# EAGLE design WCRL_Board_V3 (EAGLE 9.6.2)
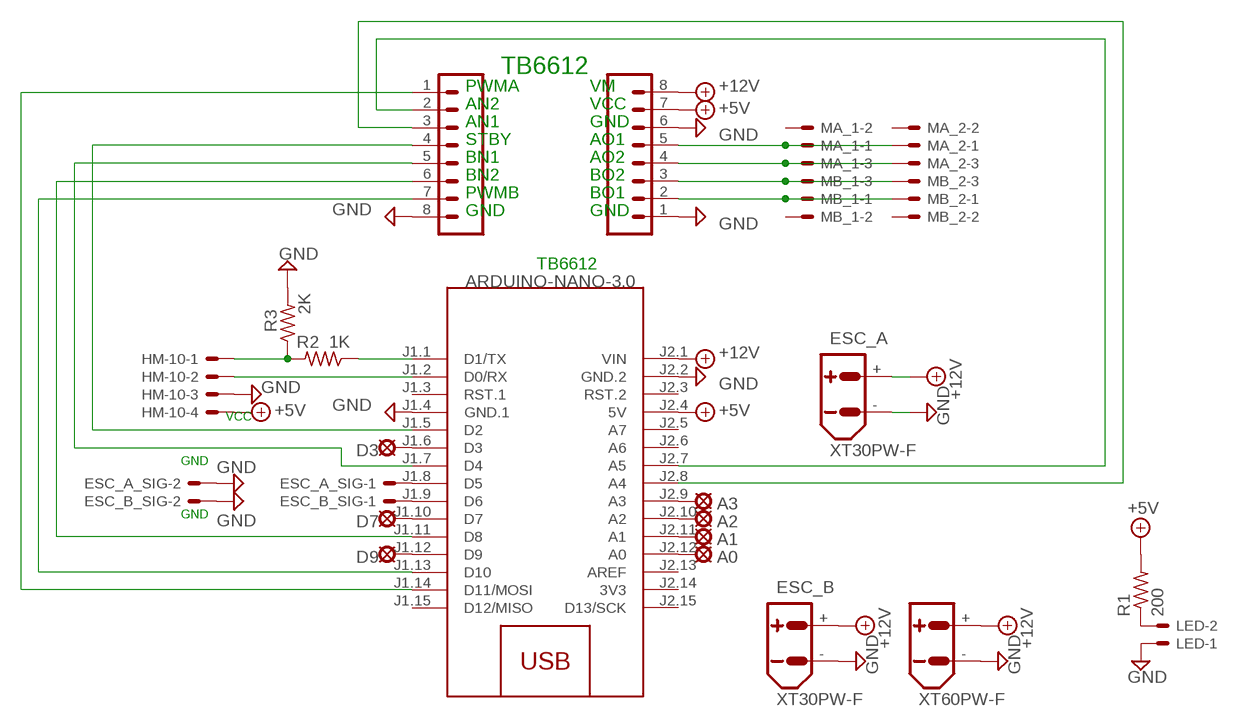
[diagram p0: schematic, sheet 1]

## Parts
A0  LSP10  [LSP10]
A1  LSP10  [LSP10]
A2  LSP10  [LSP10]
A3  LSP10  [LSP10]
BATTERY  XT60PW-F  [XT60PW-F]
D3  LSP10  [LSP10]
D7  LSP10  [LSP10]
D9  LSP10  [LSP10]
ESC_A  XT30PW-F  [XT30PW-F]
ESC_A_SIG  JST-XH-02-PIN-LONG-PAD  [JST-XH-02-PACKAGE-LONG-PAD]
ESC_B  XT30PW-F  [XT30PW-F]
ESC_B_SIG  JST-XH-02-PIN-LONG-PAD  [JST-XH-02-PACKAGE-LONG-PAD]
HM-10  JST-XH-04-PIN-LONG-PAD  [JST-XH-04-PACKAGE-LONG-PAD]
J1  CONN_08NO_SILK_FEMALE_PTH  [1X08_NO_SILK]
J2  CONN_08NO_SILK_FEMALE_PTH  [1X08_NO_SILK]
LED  JST-XH-02-PIN-LONG-PAD  [JST-XH-02-PACKAGE-LONG-PAD]
M1  ARDUINO-NANO-3.0  [ARDUINO-NANO-3.0]
MA_1  JST-XH-03-PIN-LONG-PAD  [JST-XH-03-PACKAGE-LONG-PAD]
MA_2  JST-XH-03-PIN-LONG-PAD  [JST-XH-03-PACKAGE-LONG-PAD]
MB_1  JST-XH-03-PIN-LONG-PAD  [JST-XH-03-PACKAGE-LONG-PAD]
MB_2  JST-XH-03-PIN-LONG-PAD  [JST-XH-03-PACKAGE-LONG-PAD]
R1  200  R-US_0204/5  [0204/5]
R2  1K  R-US_0204/5  [0204/5]
R3  2K  R-US_0204/5  [0204/5]

## Nets
+5V: HM-10.4 J1.7 M1.J2.4(5V) R1.2
+12V: BATTERY.+ ESC_A.+ ESC_B.+ J1.8 M1.J2.1(VIN)
GND: BATTERY.- ESC_A.- ESC_A_SIG.2 ESC_B.- ESC_B_SIG.2 HM-10.3 J1.1 J1.6 J2.8 LED.1 M1.J1.4(GND.1) M1.J2.2(GND.2) R3.2
N$1: D3.MP M1.J1.6(D3)
N$2: D7.MP M1.J1.10(D7)
N$3: D9.MP M1.J1.12(D9)
N$4: HM-10.1 R2.2 R3.1
N$5: ESC_A_SIG.1 M1.J1.8(D5)
N$6: ESC_B_SIG.1 M1.J1.9(D6)
N$7: M1.J1.1(D1/TX) R2.1
N$8: J2.4 M1.J1.5(D2)
N$9: J2.3 M1.J2.8(A4)
N$10: J1.5 MA_1.1 MA_2.1
N$11: J1.4 MA_1.3 MA_2.3
N$12: J1.2 MB_1.1 MB_2.1
N$13: J1.3 MB_1.3 MB_2.3
N$14: HM-10.2 M1.J1.2(D0/RX)
N$15: J2.2 M1.J2.7(A5)
N$16: J2.5 M1.J1.7(D4)
N$17: J2.6 M1.J1.11(D8)
N$18: LED.2 R1.1
N$20: J2.7 M1.J1.13(D10)
N$21: J2.1 M1.J1.14(D11/MOSI)
N$24: A3.MP M1.J2.9(A3)
N$25: A1.MP M1.J2.11(A1)
N$27: A0.MP M1.J2.12(A0)
N$28: A2.MP M1.J2.10(A2)
Unconnected: M1.J1.3(RST.1) M1.J1.15(D12/MISO) M1.J2.3(RST.2) M1.J2.5(A7) M1.J2.6(A6) M1.J2.13(AREF) M1.J2.15(D13/SCK) MA_1.2 MA_2.2 MB_1.2 MB_2.2

## Notes on the sheet
- TB6612
- PWMA | VM
- AN2 | VCC
- AN1 | GND
- STBY | AO1
- BN1 | AO2
- BN2 | BO2
- PWMB | BO1
- GND | GND
- TB6612
- VCC
- GND
- GND

## Power pins joined to a net without a drawn wire
3V3: M1.J2.14(3V3)

## Library data of the parts
A0 A1-A3 D3 D7 D9 = solpad:LSP10: SOLDER PAD drill 1.0 mm, distributor Buerklin, 12H555
BATTERY = xt30:XT60: AMASS XT60 connector Store in Japan AMASS XT60 connector <https://szc.jp/ams-xt60>
ESC_A ESC_B = xt30:XT30: AMASS XT30 connector Store in Japan AMASS XT30 connector <https://szc.jp/ams-xt30>
ESC_A_SIG ESC_B_SIG LED = Rembrandt Electronics - JST XH Connectors v1-0:JST-XH-02-PIN: JST XH Connector 2 Pin Wire to board connector. Pitch: 2,54 mm, (0.100") Number of pins: 2 Created by Rembrandt Electronics www.rembrandtelectronics.com
HM-10 = Rembrandt Electronics - JST XH Connectors v1-0:JST-XH-04-PIN: JST XH Connector 2 Pin Wire to board connector. Pitch: 2,54 mm, (0.100") Number of pins: 4 Created by Rembrandt Electronics www.rembrandtelectronics.com
J1 J2 = SparkFun-Connectors:CONN_08: Multi connection point. Often used as Generic Header-pin footprint for 0.1 inch spaced/style header connections On any of the 0.1 inch spaced packages, you can populate with these: Break Away Headers - Straight <https://www.sparkfun.com/products/116> (PRT-00116) Break Away Male Headers - Right Angle <https://www.sparkfun.com/products/553> (PRT-00553) Female Headers <https://www.sparkfun.com/products/115> (PRT-00115) Break Away Headers - Machine Pin <https://www.sparkfun.com/products/117> (PRT-00117) Break Away Female Headers - Swiss Machine Pin <https://www.sparkfun.com/products/743> (PRT-00743) Arduino Stackable Header - 8 Pin <https://www.sparkfun.com/products/9279> (PRT-09279) For SCREWTERMINALS and SPRING TERMINALS visit here: Screw Terimnals on SparkFun.com <https://www.sparkfun.com/search/results?term=Screw+Terminals> (5mm/3.5mm/2.54mm spacing) This device is also useful as a general connection point to wire up your design to another part of your project. Our various solder wires solder well into these plated through hole pads. Hook-Up Wire - Assortment (Stranded, 22 AWG) <https://www.sparkfun.com/products/11375> (PRT-11375) Hook-Up Wire - Assortment (Solid Core, 22 AWG) <https://www.sparkfun.com/products/11367> (PRT-11367) View the entire wire category on our website here <https://www.sparkfun.com/categories/141> Special notes: Molex polarized connector foot print use with SKU : PRT-08231 with associated crimp pins and housings. 1MM SMD Version SKU: PRT-10208 NOTES ON THE VARIANTS LOCK and LOCK_LONGPADS... This footprint was designed to help hold the alignment of a through-hole component (i.e. 6-pin header) while soldering it into place. You may notice that each hole has been shifted either up or down by 0.005 of an inch from it's more standard position (which is a perfectly straight line). This slight alteration caused the pins (the squares in the middle) to touch the edges of the holes. Because they are alternating, it causes a "brace" to hold the component in place. 0.005 has proven to be the perfect amount of "off-center" position when using our standard breakaway headers. Although looks a little odd when you look at the bare footprint, once you have a header in there, the alteration is very hard to notice. Also,if you push a header all the way into place, it is covered up entirely on the bottom side.; PROD_ID: CONN-08438
M1 = diy-modules:ARDUINO-NANO-3.0: Arduino Nano 3.0 and compatible devices More details available here: https://www.arduino.cc/en/Main/ArduinoBoardNano Click here to find device on ebay.com <http://www.ebay.com/sch/arduino+nano>
MA_1 MA_2 MB_1 MB_2 = Rembrandt Electronics - JST XH Connectors v1-0:JST-XH-03-PIN: JST XH Connector 2 Pin Wire to board connector. Pitch: 2,54 mm, (0.100") Number of pins: 3 Created by Rembrandt Electronics www.rembrandtelectronics.com
R1-R3 = BeagleBone_Black_Wireless:R-US_: RESISTOR, American symbol

## Board
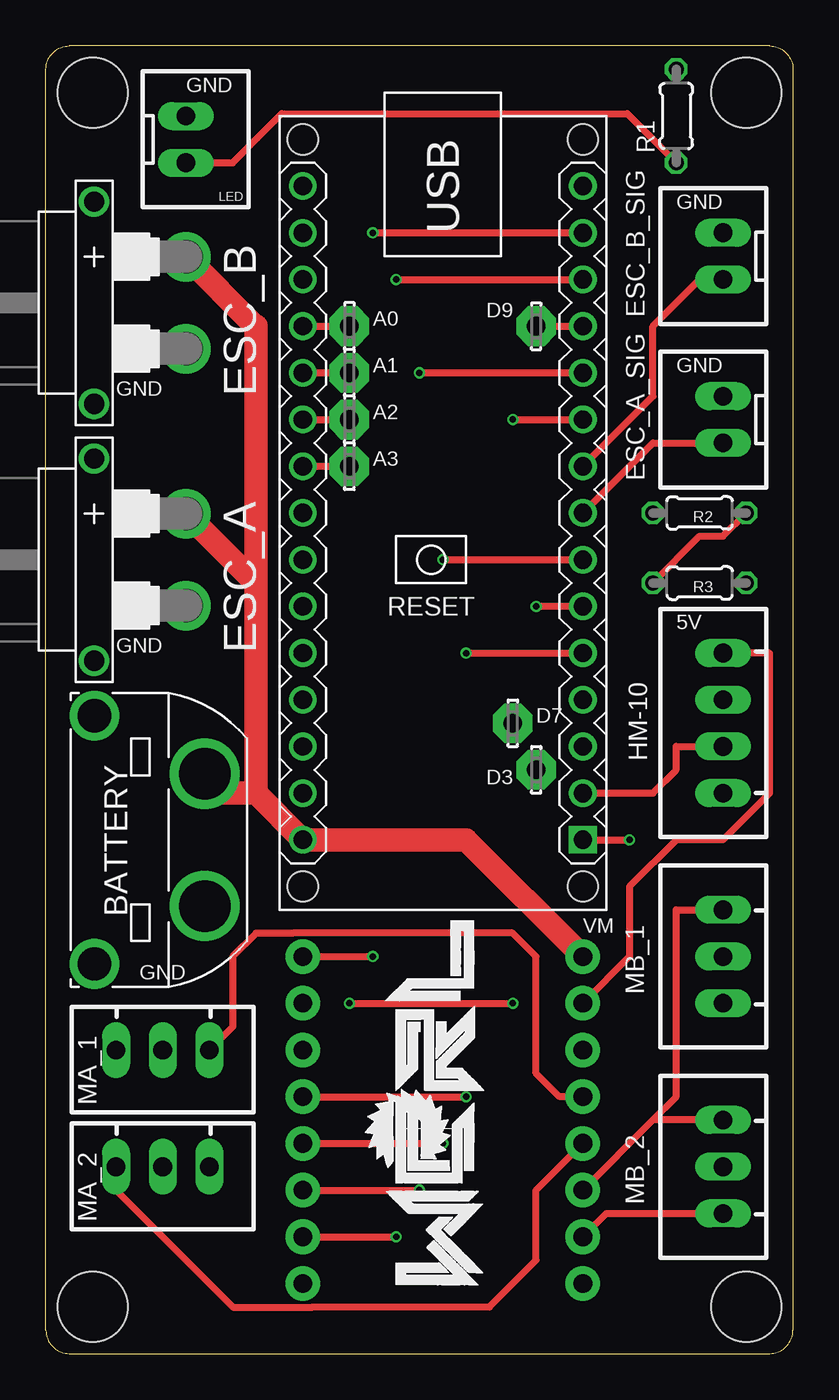
[diagram p1: board, top side]
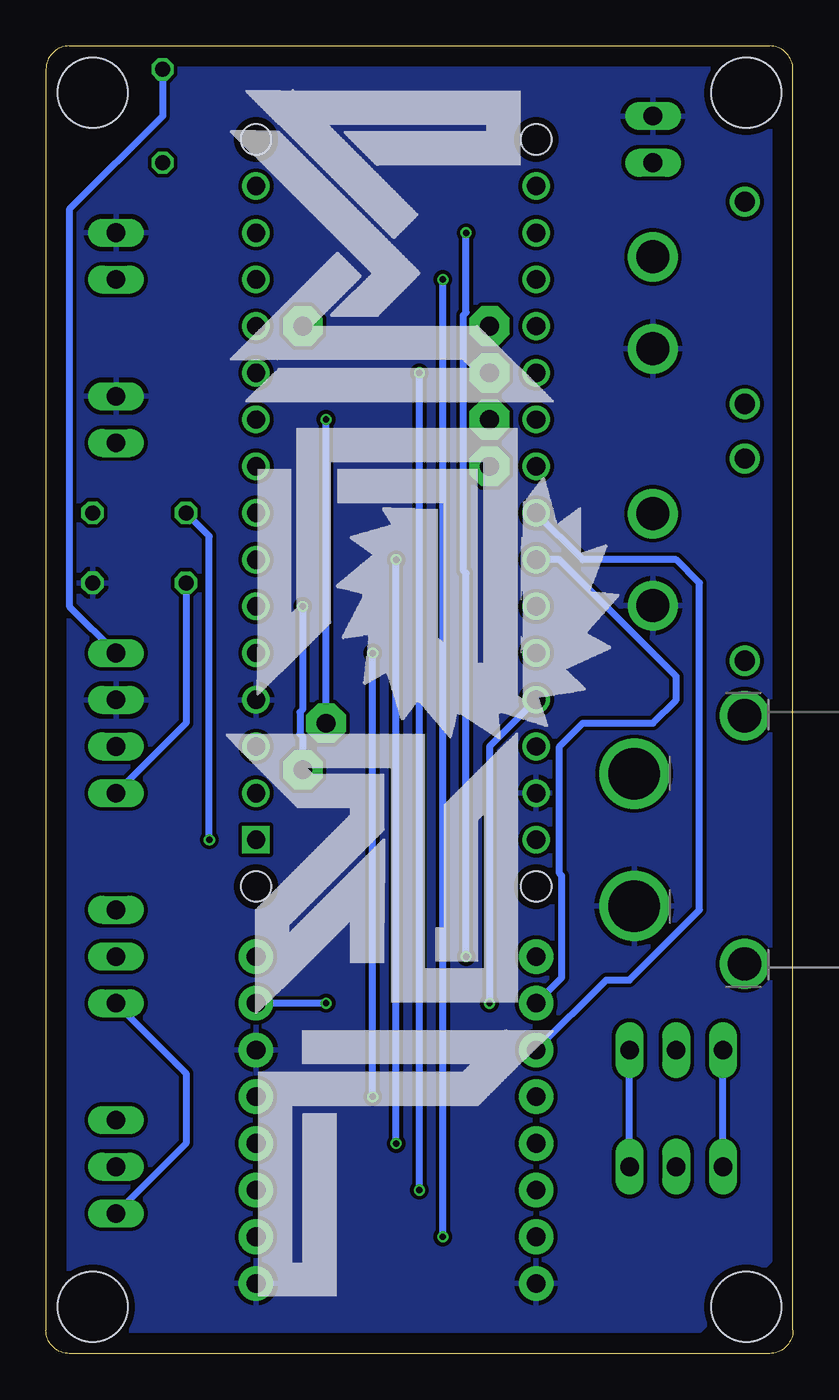
[diagram p2: board, bottom side, seen from below]

Size 40.64 x 71.12 mm. Coordinates in mm from the lower left corner, seen from the top.
Outline: 40.64,69.85 40.64,1.27 arc-90 39.37,0 1.27,0 arc-90 0,1.27 0,69.85 arc-90 1.27,71.12 39.37,71.12 arc-90 40.64,69.85
Copper layers (1*16): Top 0.035559375mm / dielectric 1.6mm / Bottom 0.035559375mm
Design rules "oshpark-2layer *": minimum track width 15mil, minimum drill 10mil, track to track 8mil, track to pad 6mil, pad to pad 6mil, via to via 6mil, smd to smd 6mil, copper to edge 15mil, drill to drill 6mil, minimum pad ring 5mil, minimum via ring 5mil, stop-mask expansion 2.5mil, vias tented up to drill 0mil, thermal gap 10mil
Holes 3.81 mm at 2.54,68.58 38.1,2.54 2.54,2.54 38.1,68.58

### Footprints (pad centres in the part's own frame; a part is rotated, then mirrored left to right if it is on the bottom)
LSP10 = drill 1.016 pad 2.159 octagon: MP 0,0
XT60PW-F = drill 2.8: + -3.6,0; - 3.6,0 | drill 1.8: P$3 -6.75,6; P$4 6.75,6
XT30PW-F = drill 1.8: + 2.5,0; - -2.5,0 | drill 1.1: P$3 -5.5,5; P$4 5.5,5
JST-XH-02-PACKAGE-LONG-PAD = drill 1.016 long: 1 -1.27,0; 2 1.27,0
JST-XH-04-PACKAGE-LONG-PAD = drill 1.016 long: 1 -3.81,0; 2 -1.27,0; 3 1.27,0; 4 3.81,0
1X08_NO_SILK = drill 1.016 pad 1.88: 1 0,0; 2 2.54,0; 3 5.08,0; 4 7.62,0; 5 10.16,0; 6 12.7,0; 7 15.24,0; 8 17.78,0
ARDUINO-NANO-3.0 = drill 1 square: J1.1 17.78,7.62 | drill 1: J1.2 15.24,7.62; J1.3 12.7,7.62; J1.4 10.16,7.62; J1.5 7.62,7.62; J1.6 5.08,7.62; J1.7 2.54,7.62; J1.8 0,7.62; J1.9 -2.54,7.62; J1.10 -5.08,7.62; J1.11 -7.62,7.62; J1.12 -10.16,7.62; J1.13 -12.7,7.62; J1.14 -15.24,7.62; J1.15 -17.78,7.62; J2.1 17.78,-7.62; J2.2 15.24,-7.62; J2.3 12.7,-7.62; J2.4 10.16,-7.62; J2.5 7.62,-7.62; J2.6 5.08,-7.62; J2.7 2.54,-7.62; J2.8 0,-7.62; J2.9 -2.54,-7.62; J2.10 -5.08,-7.62; J2.11 -7.62,-7.62; J2.12 -10.16,-7.62; J2.13 -12.7,-7.62; J2.14 -15.24,-7.62; J2.15 -17.78,-7.62 | hole 1.651: -20.32,7.62; -20.32,-7.62; 20.32,-7.62; 20.32,7.62
JST-XH-03-PACKAGE-LONG-PAD = drill 1.016 long: 1 -2.54,0; 2 0,0; 3 2.54,0
0204/5 = drill 0.813 octagon: 1 -2.54,0; 2 2.54,0

### Placement (x,y rotation side)
A0  16.51,55.88 270 top
A1  16.51,53.34 270 top
A2  16.51,50.8 270 top
A3  16.51,48.26 270 top
BATTERY  8.64,27.94 270 bottom
D3  26.67,31.75 90 top
D7  25.4,34.29 90 top
D9  26.67,55.88 90 top
ESC_A  7.62,43.18 90 top
ESC_A_SIG  36.83,50.8 90 top
ESC_B  7.62,57.15 90 top
ESC_B_SIG  36.83,59.69 90 top
HM-10  36.83,34.29 90 top
J1  29.21,3.81 90 top
J2  13.97,21.59 270 top
LED  7.62,66.04 270 top
M1  21.59,45.72 270 top
MA_1  6.35,16.51 180 top
MA_2  6.35,10.16 180 top
MB_1  36.83,21.59 90 top
MB_2  36.83,10.16 90 top
R1  34.29,67.31 90 top
R2  35.56,45.72 0 top
R3  35.56,41.91 0 top

### Tracks (layer width: path | path; a pad name or v marks a point on that pad's centre or on a via)
+5V  (via drill 0.35)
  Top 0.381: v16.51,19.05 v25.4,19.05 | J1.7 31.75,21.59 31.75,25.4 34.29,27.94 36.83,27.94 39.37,30.48 39.37,38.1 HM-10.4
  Bottom 0.381: M1.J2.4 16.51,33.02 v16.51,19.05 | v25.4,19.05 J1.7 | R1.2 34.29,67.31 39.37,62.23 39.37,40.64 HM-10.4
+12V
  Top 1.27: ESC_A.+ 11.43,41.87 | 11.43,41.87 11.43,30.48 | 11.43,30.48 M1.J2.1 22.86,27.94 J1.8 | ESC_B.+ 11.39,55.88 11.43,55.88 11.43,41.87 | BATTERY.+ 9.7,30.48 11.43,30.48
GND
  pour Bottom: 1.27,5.08 5.08,1.27 36.83,1.27 39.37,3.81 39.37,67.31 36.83,69.85 3.81,69.85 1.27,67.31
N$1  (via drill 0.35)
  Top 0.381: M1.J1.6 v26.67,40.64
  Bottom 0.381: v26.67,40.64 26.67,35.03 26.82,34.88 26.82,33.7 26.67,33.55 D3.MP
N$2  (via drill 0.35)
  Top 0.381: v25.4,50.8 M1.J1.10
  Bottom 0.381: D7.MP v25.4,50.8
N$3
  Top 0.381: D9.MP M1.J1.12
N$4
  Top 0.381: R3.1 35.56,44.45 36.83,44.45 R2.2
  Bottom 0.381: R3.1 33.02,34.29 HM-10.1
N$5
  Top 0.381: M1.J1.8 33.02,49.53 ESC_A_SIG.1
N$6
  Top 0.381: M1.J1.9 33.02,52.07 33.02,55.88 35.56,58.42 ESC_B_SIG.1
N$7  (via drill 0.35)
  Top 0.381: M1.J1.1 v31.75,27.94
  Bottom 0.381: v31.75,27.94 31.75,44.45 R2.1
N$8  (via drill 0.35)
  Top 0.381: J2.4 v22.86,13.97 | v22.86,38.1 M1.J1.5
  Bottom 0.381: v22.86,13.97 v22.86,38.1
N$9
  Bottom 0.381: J2.3 10.16,20.32 8.89,20.32 5.08,24.13 5.08,41.91 6.35,43.18 11.43,43.18 M1.J2.8
N$10
  Top 0.381: J1.5 27.94,13.97 26.67,15.24 26.67,21.59 25.39,22.87 13.44,22.87 13.43,22.86 11.43,22.86 10.16,21.59 10.16,17.78 MA_1.1
  Bottom 0.381: MA_2.1 MA_1.1
N$11
  Top 0.381: MA_2.3 3.81,8.89 10.17,2.53 14.5,2.53 14.51,2.54 24.13,2.54 26.67,5.08 26.67,8.89 J1.4
  Bottom 0.381: MA_2.3 MA_1.3
N$12
  Top 0.381: MB_2.1 30.48,7.62 J1.2
  Bottom 0.381: MB_1.1 33.02,15.24 33.02,11.43 MB_2.1
N$13
  Top 0.381: J1.3 33.02,12.7 | 33.02,12.7 34.29,13.97 34.29,24.13 MB_1.3 | MB_2.3 33.02,12.7
N$14
  Top 0.381: M1.J1.2 33.02,30.48 34.29,31.75 34.29,33.02 HM-10.2
N$15
  Bottom 0.381: J2.2 12.57,20.45 12.57,25.98 12.7,26.11 12.7,33.02 11.43,34.29 7.62,34.29 6.35,35.56 6.35,36.83 12.7,43.18 M1.J2.7
N$16  (via drill 0.35)
  Top 0.381: J2.5 v21.59,11.43 | v21.59,43.18 M1.J1.7
  Bottom 0.381: v21.59,11.43 v21.59,43.18
N$17  (via drill 0.35)
  Top 0.381: J2.6 v20.32,8.89 | v20.32,53.34 M1.J1.11
  Bottom 0.381: v20.32,8.89 v20.32,53.34
N$18
  Top 0.381: LED.2 10.16,64.77 12.83,67.44 31.62,67.44 R1.1
N$20  (via drill 0.35)
  Top 0.381: J2.7 v19.05,6.35 | v19.05,58.42 M1.J1.13
  Bottom 0.381: v19.05,6.35 v19.05,58.42
N$21  (via drill 0.35)
  Top 0.381: J2.1 v17.78,21.59 | v17.78,60.96 M1.J1.14
  Bottom 0.381: v17.78,21.59 17.78,42.44 17.93,42.59 17.93,56.47 17.78,56.62 v17.78,60.96
N$24
  Top 0.381: M1.J2.9 A3.MP
N$25
  Top 0.381: M1.J2.11 A1.MP
N$27
  Top 0.381: M1.J2.12 A0.MP
N$28
  Top 0.381: M1.J2.10 A2.MP

### Text on the board
tPlace: C:/Users/dillo/Desktop/wcrl.bmp
bPlace: C:/Users/dkane3/Downloads/WCRL_Merch_Logo_black_bottom.bmp
tNames: GND | GND | GND | GND | 5V | GND | VM | GND